# EasyEDA Pro project proprj_esp_s3_crokpocket_2025-06-12.epro, board PCB7
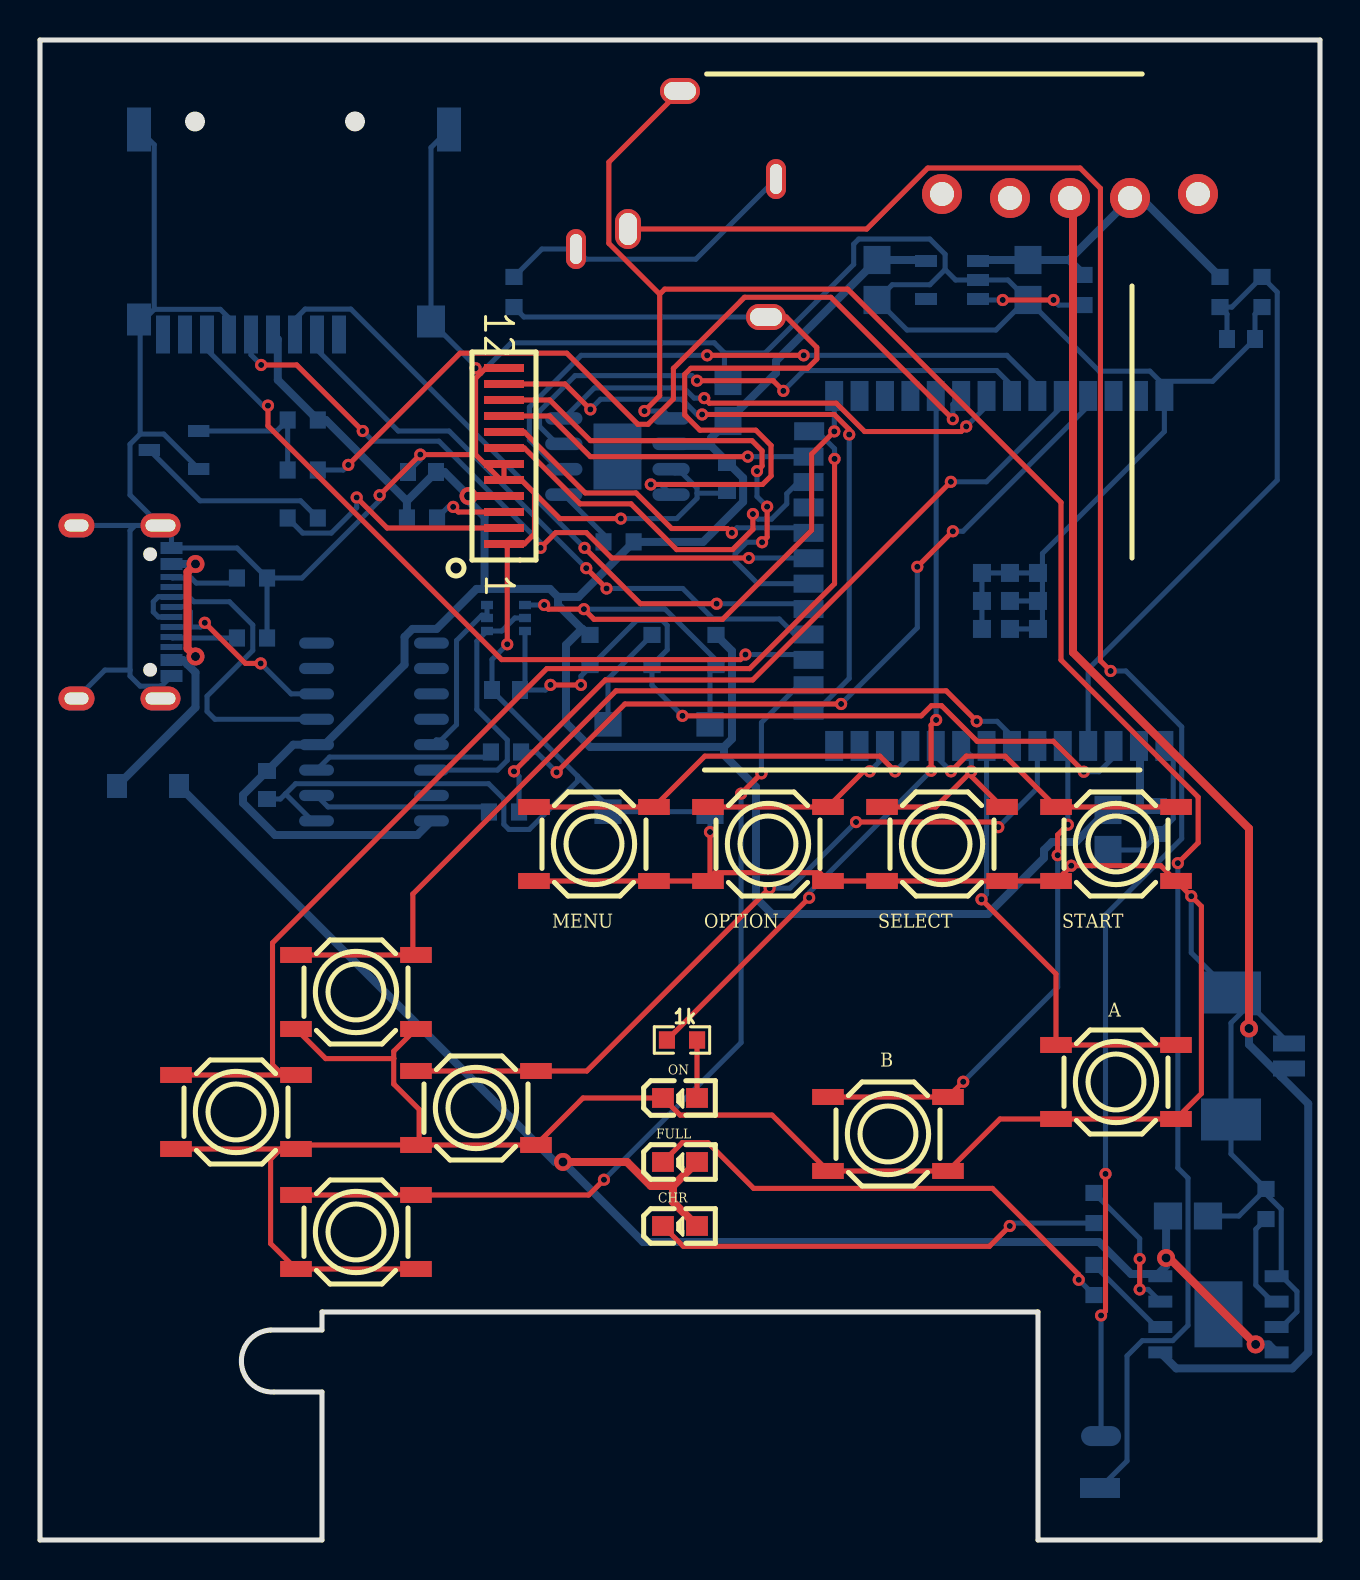
[diagram p1: board, top side]
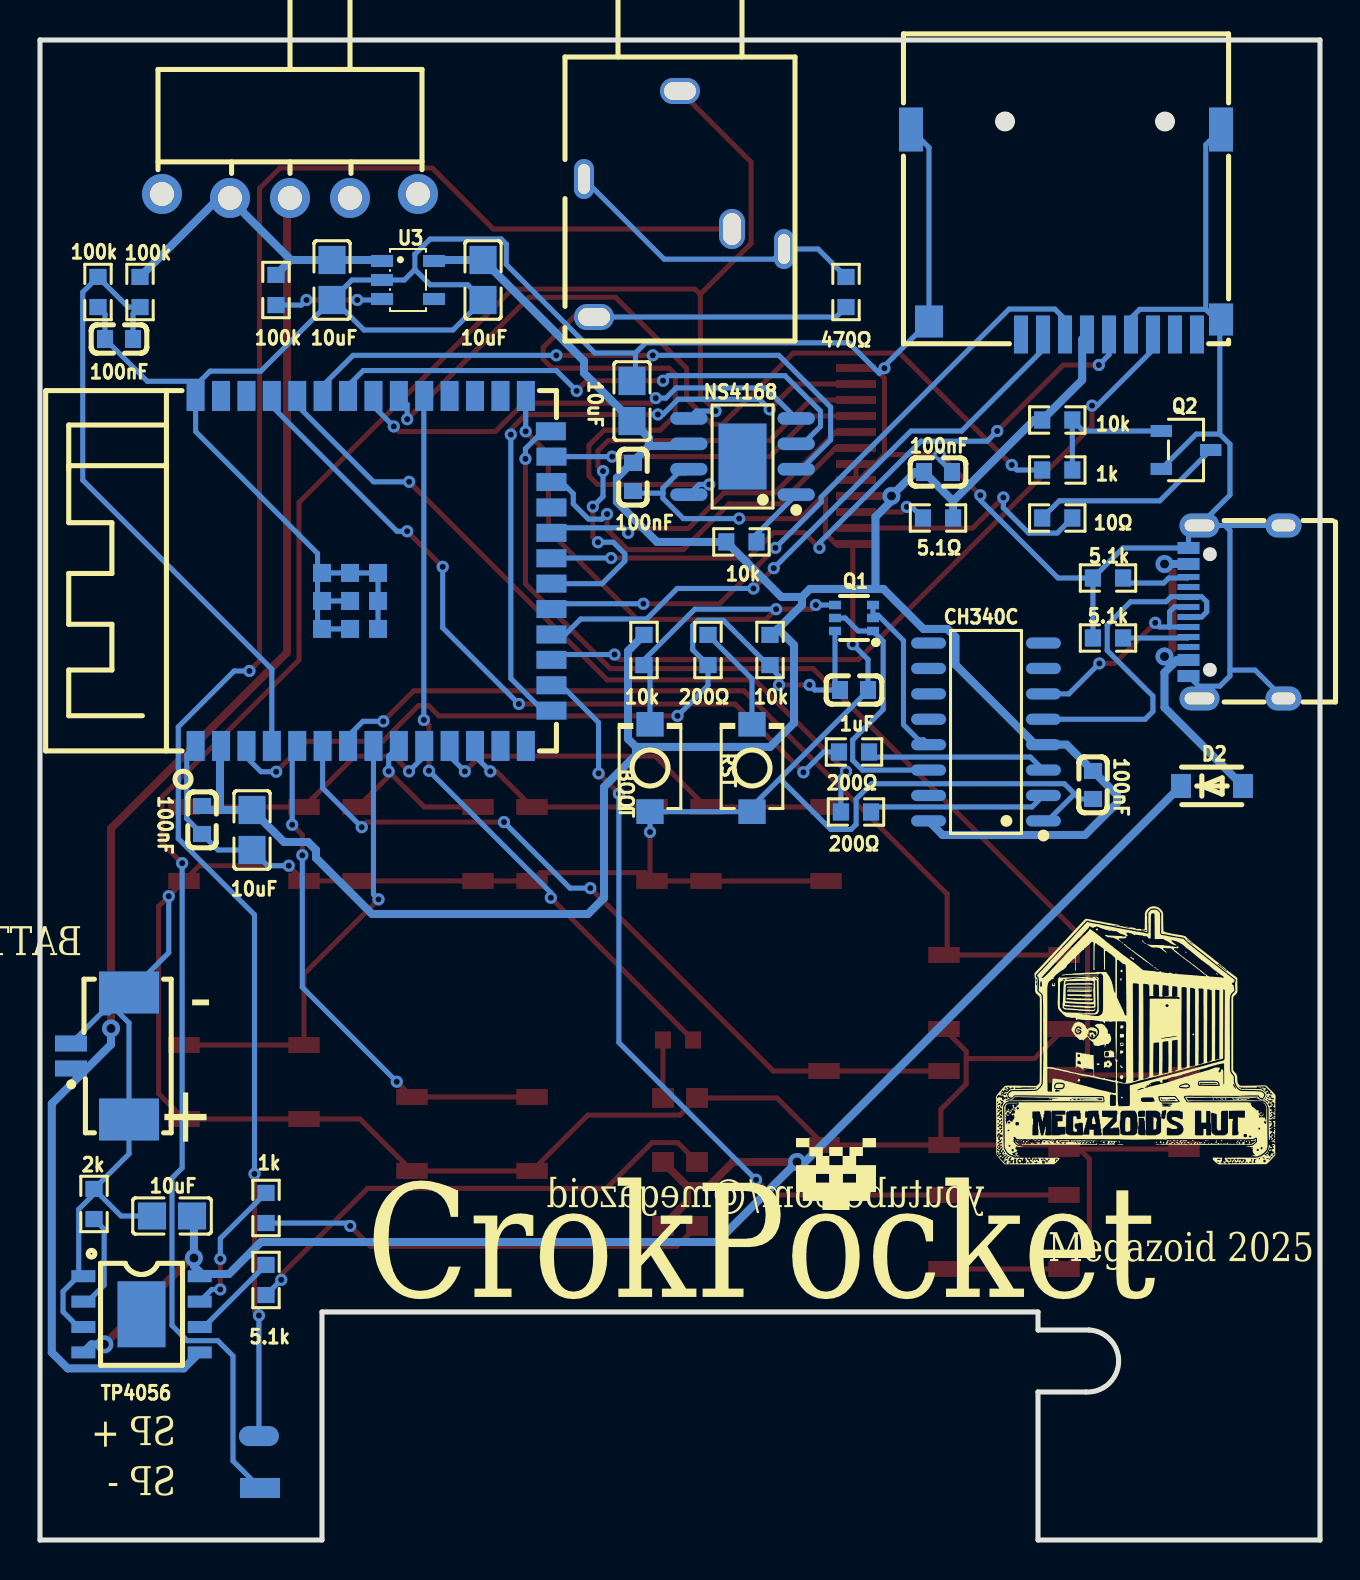
[diagram p2: board, bottom side, seen from below]

Outline 64 x 75 mm; copper layers: Top Layer, Bottom Layer. Coordinates in mm from the lower left corner of the outline.
Outline path: 0,75 64,75 64,0 49.9,0 49.9,11.4 14.1,11.4 14.1,10.5 11.54,10.5 arc(10.07,8.87) 11.7,7.4 14.1,7.4 14.1,0 0,0 0,75
Stack: Top Layer 0.035mm / Dielectric1 1.51mm FR4 er 4.5 / Bottom Layer 0.035mm

## Design rules (mm)
template: Custom Config
spacing copperThickness1oz (default): track to track 0.102, other pairs 0.152 to 0.3
spacing copperThickness2oz: track to track 0.203, other pairs 0.152 to 0.3
track width copperThickness1oz (default): min 0.127, default 0.254, max 2.54
track width copperThickness2oz: min 0.203, default 0.254, max 2.54
track width fat_trace: min 0.127, default 0.4, max 2.54
differential pair differentialPair (default): width min 0.127, default 0.254, max 2.54; gap min 0.152, default 0.152
via viaSize (default): diameter min 0.5, default 0.61, max 10; hole min 0.3, default 0.305, max 6.3
via fat_via: diameter min 0.5, default 0.9, max 10; hole min 0.3, default 0.45, max 6.3
net VCC uses fat_trace, fat_via
net VBUS uses fat_trace, fat_via
net $1N2657 uses fat_trace, fat_via
net BAT+ uses fat_trace, fat_via
net +5V uses fat_trace, fat_via

## Placement (name value [footprint] x y rotation side)
1k  -  [R0603]  32.1 25 0 top
1k#2  -  [R0603]  13.14 53.5 180 bottom
1k#3  -  [R0603]  52.7 16.6 90 bottom
1uF  1uF  [C0603]  23.3 42.5 180 bottom
2k  2kΩ  [R0603]  61.3 16.8 270 bottom
5.1k  -  [R0603]  52.7 13 90 bottom
5.1k#2  -  [R0603]  10.6 48.1 0 bottom
5.1k#3  -  [R0603]  10.6 45.1 0 bottom
5.1Ω  6.2Ω  [R0603]  19.1 51.1 0 bottom
10k  -  [R0603]  13.14 56 180 bottom
10k#2  -  [R0603]  27.5 44.5 90 bottom
10k#3  -  [R0603]  33.8 44.5 270 bottom
10k#4  -  [R0603]  28.93 49.91 0 bottom
10uF  -  [C0805]  53.4 35.5 270 bottom
10uF#2  -  [C0805]  41.85 63 90 bottom
10uF#3  -  [C0805]  49.4 63 90 bottom
10uF#4  -  [C0805]  57.4 16.2 0 bottom
10uF#5  -  [C0805]  34.4 56.95 270 bottom
10Ω  10Ω  [R0603]  13.14 51.1 180 bottom
100k  -  [R0603]  52.2 62.5 270 bottom
100k#2  -  [R0603]  59 62.4 90 bottom
100k#3  -  [R0603]  61.1 62.4 90 bottom
100nF  -  [C0603]  60.05 60.05 0 bottom
100nF#2  -  [C0603]  19.1 53.4 0 bottom
100nF#3  -  [C0603]  11.35 37.75 270 bottom
100nF#4  -  [C0603]  55.9 36 270 bottom
100nF#5  -  [C0603]  34.35 53.15 90 bottom
200Ω  -  [R0603]  23.2 36.4 180 bottom
200Ω#2  -  [R0603]  23.3 39.4 180 bottom
200Ω#3  -  [R0603]  30.6 44.5 270 bottom
470Ω  470Ω  [R0603]  23.7 62.4 90 bottom
A  GT-TC084E-H020-L5  [SW-SMD_4P-L5.2-W5.2-P3.70-LS6.4]  53.8 22.9 0 top
AUDIO1  PJ-3240-5A  [AUDIO-TH_PJ-3240-5A]  31.8 66.8 180 bottom
B  GT-TC084E-H020-L5  [SW-SMD_4P-L5.2-W5.2-P3.70-LS6.4]  42.4 20.3 0 top
BOOT  GT-TC029B-H025-L1N  [SW-SMD_L3.9-W3.0-P4.45]  33.5 38.6 90 bottom
CARD1  MR01A-01211  [TF-SMD_MR01A-01211]  12.7 65.4 0 bottom
CH340C  CH340C  [SOP-16_L10.0-W3.9-P1.27-LS6.0-BL]  16.7 40.4 90 bottom
CHR  RED  [LED-0603]  32 15.7 0 top
D2  SS14L  [SOD-123F_L2.8-W1.8-LS3.7-RD]  5.4 37.7 180 bottom
FULL  GREEN  [LED-0603]  32 18.9 0 top
H1  532610271  [CONN-SMD_532610271]  61 24.2 270 bottom
KEY_DOWN  GT-TC084E-H020-L5  [SW-SMD_4P-L5.2-W5.2-P3.70-LS6.4]  15.8 15.4 0 top
KEY_LEFT  GT-TC084E-H020-L5  [SW-SMD_4P-L5.2-W5.2-P3.70-LS6.4]  9.8 21.4 0 top
KEY_RIGHT  GT-TC084E-H020-L5  [SW-SMD_4P-L5.2-W5.2-P3.70-LS6.4]  21.8 21.6 0 top
KEY_UP  GT-TC084E-H020-L5  [SW-SMD_4P-L5.2-W5.2-P3.70-LS6.4]  15.8 27.4 0 top
LCD1  -  [LCD DISPLAY ER-TFT020-2]  23.2 54.2 180 top
MENU  HX TS5220A 160GF  [SW-SMD_4P-L5.2-W5.2-P3.70-LS6.4]  27.7 34.8 0 top
NS4168  NS4168  [ESOP-8_L4.9-W3.9-P1.27-LS6.0-BL-EP-1]  28.87 54.17 90 bottom
ON  GREEN  [LED-0603]  32 22.1 0 top
OPTION  HX TS5220A 160GF  [SW-SMD_4P-L5.2-W5.2-P3.70-LS6.4]  36.4 34.8 0 top
Q1  UMH3N  [SC-70-6_L2.2-W1.3-P0.65-LS2.1-BR]  23.3 46.1 180 bottom
Q2  S8050  [SOT-23-3_L2.9-W1.6-P1.90-LS2.8-BR]  6.7 54.5 0 bottom
RST  GT-TC029B-H025-L1N  [SW-SMD_L3.9-W3.0-P4.45]  28.4 38.6 90 bottom
SELECT  HX TS5220A 160GF  [SW-SMD_4P-L5.2-W5.2-P3.70-LS6.4]  45.1 34.8 0 top
START  HX TS5220A 160GF  [SW-SMD_4P-L5.2-W5.2-P3.70-LS6.4]  53.8 34.8 0 top
SW1  KH-SS12F23-G6  [SW-TH_KH-SS12F23-G6]  51.5 67.2 0 bottom
TP1  -  [Test-Point-0.5mm]  53.05 5.2 180 bottom
TP2  -  [Test-Point-0.5mm#2]  53 2.6 180 bottom
TP4056  TP4056-42-ESOP8  [ESOP-8_L4.9-W3.9-P1.27-LS6.0-BL-EP]  58.92 11.28 270 bottom
U1  ESP32-S3-WROOM-1-N16R8  [WIRELM-SMD_ESP32-S3-WROOM-1]  47.32 48.45 90 bottom
U3  XC6210B332MR-G  [SOT-23-5_L3.0-W1.7-P0.95-LS2.8-BR]  45.6 63 0 bottom
USB1  TYPE-C 16PIN 2MD(073)  [USB-C-SMD_TYPE-C-6PIN-2MD-073]  4.2 46.4 90 bottom

## Footprints (pads in the part's own frame, mm; a bottom-side part is the same pattern mirrored in y, then rotated)
AUDIO-TH_PJ-3240-5A
  oval 2x1.3 hole 1.6x0.9: 1(-0.2,5.65)
  oval 1x2 hole 0.6x1.502: 2(-5,1.248) 3(5,-2.252)
  oval 2x1.3 hole 1.601x0.9: 4(-4.5,-5.65)
  oval 1.3x2 hole 0.9x1.601: 5(2.4,-1.251)
C0603
  rect 0.8x0.9 smd: 1(-0.7,0) 2(0.7,0)
C0805
  rect 1.41x1.35 smd: 1(-1,0) 2(1,0)
CONN-SMD_532610271
  rect 0.8x1.6 smd: 1(0.625,-1.45) 2(-0.625,-1.45)
  rect 2.1x3 smd: 3(3.175,1.45) 4(-3.175,1.45)
ESOP-8_L4.9-W3.9-P1.27-LS6.0-BL-EP
  rect 0.6x1.2 smd: 1(-1.905,-2.909) 2(-0.635,-2.909) 3(0.635,-2.909) 4(1.905,-2.909) 5(1.905,2.909) 6(0.635,2.909) 7(-0.635,2.909) 8(-1.905,2.909)
  rect 3.3x2.4 smd: 9(0,0)
ESOP-8_L4.9-W3.9-P1.27-LS6.0-BL-EP-1
  oval 0.63x1.865 smd: 1(-1.905,-2.683) 2(-0.635,-2.683) 3(0.635,-2.683) 4(1.905,-2.683) 5(1.905,2.683) 6(0.635,2.683) 7(-0.635,2.683) 8(-1.905,2.683)
  rect 3.3x2.4 smd: 9(0,0)
LCD DISPLAY ER-TFT020-2
  rect 2x0.4 smd: 1(0,4.4) 2(0,3.6) 3(0,2.8) 4(0,2) 5(0,1.2) 6(0,0.4) 7(0,-0.4) 8(0,-1.2) 9(0,-2) 10(0,-2.8) 11(0,-3.6) 12(0,-4.4)
LED-0603
  rect 1.092x0.991 smd: 1(0.851,0) 2(-0.851,0)
R0603
  rect 0.806x0.864 smd: 1(-0.753,0) 2(0.753,0)
SC-70-6_L2.2-W1.3-P0.65-LS2.1-BR
  rect 0.6x0.42 smd: 1(0.95,-0.65) 2(0.95,0) 3(0.95,0.65) 4(-0.95,0.65) 5(-0.95,0) 6(-0.95,-0.65)
SOD-123F_L2.8-W1.8-LS3.7-RD
  rect 1x1.2 smd: 1(-1.55,0) 2(1.55,0)
SOP-16_L10.0-W3.9-P1.27-LS6.0-BL
  oval 0.56x1.745 smd: 1(-4.445,-2.873) 2(-3.175,-2.873) 3(-1.905,-2.873) 4(-0.635,-2.873) 5(0.635,-2.873) 6(1.905,-2.873) 7(3.175,-2.873) 8(4.445,-2.873) 9(4.445,2.873) 10(3.175,2.873) 11(1.905,2.873) 12(0.635,2.873) 13(-0.635,2.873) 14(-1.905,2.873) 15(-3.175,2.873) 16(-4.445,2.873)
SOT-23-3_L2.9-W1.6-P1.90-LS2.8-BR
  rect 1.07x0.6 smd: 1(1.235,-0.95) 2(1.235,0.95) 3(-1.235,0)
SOT-23-5_L3.0-W1.7-P0.95-LS2.8-BR
  rect 1.1x0.6 smd: 1(1.3,-0.95) 2(1.3,0) 3(1.3,0.95) 4(-1.3,0.95) 5(-1.3,-0.95)
SW-SMD_4P-L5.2-W5.2-P3.70-LS6.4
  rect 1.58x0.8 smd: 1(-3,1.85) 2(3,1.85) 3(-3,-1.85) 4(3,-1.85)
SW-SMD_L3.9-W3.0-P4.45
  rect 1.23x1.36 smd: 1(-2.185,0) 2(2.185,0)
SW-TH_KH-SS12F23-G6
  round 2 hole 1.2: 1(-3,0.1) 2(0,0.1) 3(3,0.1) 4(6.4,-0.1) 5(-6.4,-0.1)
Test-Point-0.5mm
  oval 2x1 smd: 1(0,0)
Test-Point-0.5mm#2
  rect 2x1 smd: 1(0,0)
TF-SMD_MR01A-01211
  rect 0.7x1.9 smd: 1(2.25,5.125) 2(1.15,5.125) 3(0.05,5.125) 4(-1.05,5.125) 5(-2.15,5.125) 6(-3.25,5.125) 7(-4.35,5.125) 8(-5.45,5.125) 9(-6.55,5.125)
  rect 1.2x1.6 smd: 10(-7.75,4.375)
  rect 1.2x2.2 smd: 11(-7.75,-5.125) 12(7.75,-5.125)
  rect 1.4x1.6 smd: 13(6.85,4.475)
USB-C-SMD_TYPE-C-6PIN-2MD-073
  rect 0.6x1.1 smd: 1(-3.2,2.375) 2(-2.4,2.375) 11(2.4,2.375) 12(3.2,2.375)
  rect 0.3x1.1 smd: 3(-1.75,2.375) 4(-1.25,2.375) 5(-0.75,2.375) 6(-0.25,2.375) 7(0.25,2.375) 8(0.75,2.375) 9(1.25,2.375) 10(1.75,2.375)
  oval 1.2x1.8 hole 0.6x1.2: 13(-4.325,-2.375) 14(4.325,-2.375)
  oval 1.2x2 hole 0.6x1.5: 13(-4.325,1.825) 14(4.325,1.825)
WIRELM-SMD_ESP32-S3-WROOM-1
  rect 1.5x0.9 smd: 1(-8.75,8.895) 2(-8.75,7.625) 3(-8.75,6.355) 4(-8.75,5.085) 5(-8.75,3.815) 6(-8.75,2.545) 7(-8.75,1.275) 8(-8.75,0.005) 9(-8.75,-1.265) 10(-8.75,-2.535) 11(-8.75,-3.805) 12(-8.75,-5.075) 13(-8.75,-6.345) 14(-8.75,-7.615) 27(8.75,-7.615) 28(8.75,-6.345) 29(8.75,-5.075) 30(8.75,-3.805) 31(8.75,-2.535) 32(8.75,-1.265) 33(8.75,0.005) 34(8.75,1.275) 35(8.75,2.545) 36(8.75,3.815) 37(8.75,5.085) 38(8.75,6.355) 39(8.75,7.625) 40(8.75,8.895)
  rect 0.9x1.5 smd: 15(-6.985,-8.895) 16(-5.715,-8.895) 17(-4.445,-8.895) 18(-3.175,-8.895) 19(-1.905,-8.895) 20(-0.635,-8.895) 21(0.635,-8.895) 22(1.905,-8.895) 23(3.175,-8.895) 24(4.445,-8.895) 25(5.715,-8.895) 26(6.985,-8.865)
  rect 0.9x0.9 smd: 41(-2.9,-0.225) 41(-2.9,1.175) 41(-2.9,2.575) 41(-1.5,-0.225) 41(-1.5,1.175) 41(-1.5,2.575) 41(-0.1,-0.225) 41(-0.1,1.175) 41(-0.1,2.575)

## Nets
+5V: 10uF#3.2 100k.1 100k#2.2 SW1.3 U3.1
GND: 1uF.2 2k.1 5.1k#2.2 5.1k#3.2 10uF.2 10uF#2.1 10uF#3.1 10uF#4.2 10uF#5.1 100k#3.1 100nF.2 100nF#2.1 100nF#3.2 100nF#4.2 100nF#5.1 A.3 A.4 B.3 B.4 BOOT.1 CARD1.6 CARD1.10 CARD1.11 CARD1.12 CARD1.13 CH340C.1 H1.2 H1.3 H1.4 KEY_DOWN.3 KEY_DOWN.4 KEY_LEFT.3 KEY_LEFT.4 KEY_RIGHT.3 KEY_RIGHT.4 KEY_UP.3 KEY_UP.4 LCD1.1 LCD1.5 LCD1.6 LCD1.12 MENU.3 MENU.4 NS4168.7 ON.2 OPTION.3 OPTION.4 Q2.2 RST.1 SELECT.3 SELECT.4 START.3 START.4 TP4056.1 TP4056.3 U1.1 U1.40 U1.41 U3.2 USB1.1 USB1.12 USB1.13 USB1.14
VBUS: 10uF#4.1 CHR.1 D2.1 FULL.1 TP4056.4 TP4056.8
VCC: 5.1Ω.1 10k.1 10k#2.2 10k#3.1 10k#4.2 10uF.1 10uF#2.2 10uF#5.2 100nF#2.2 100nF#3.1 100nF#4.1 100nF#5.2 CARD1.4 CH340C.4 CH340C.16 LCD1.4 NS4168.6 U1.2 U3.5
BAT+: H1.1 SW1.2 TP4056.5
D+: CH340C.5 USB1.6 USB1.8
D-: CH340C.6 USB1.5 USB1.7
DTR: CH340C.13 Q1.2 Q1.3
EN: 1uF.1 10k#2.1 200Ω#3.2 Q1.6 U1.3
HJ3: 470Ω.2 AUDIO1.2 AUDIO1.3
HJ_OUTP: AUDIO1.5 TP1.1
IO0: 10k#3.2 BOOT.2 Q1.4 U1.27
IO1: U1.39
IO2: U1.38
IO3: LCD1.11 U1.15
IO4: 100k#2.1 100k#3.2 100nF.1 U1.4
IO5: B.1 B.2 U1.5
IO6: KEY_RIGHT.1 KEY_RIGHT.2 U1.6
IO7: KEY_UP.1 KEY_UP.2 U1.7
IO8: OPTION.1 OPTION.2 U1.12
IO9: CARD1.7 U1.17
IO10: CARD1.2 U1.18
IO11: CARD1.3 U1.19
IO12: LCD1.10 U1.20
IO13: CARD1.5 U1.21
IO14: LCD1.8 U1.22
IO15: A.1 A.2 U1.8
IO16: SELECT.1 SELECT.2 U1.9
IO17: START.1 START.2 U1.10
IO18: MENU.1 MENU.2 U1.11
IO19: U1.13
IO20: U1.14
IO21: U1.23
IO38: 1k.1 U1.31
IO39: 1k#2.1 U1.32
IO40: NS4168.4 U1.33
IO41: NS4168.3 U1.34
IO42: NS4168.2 U1.35
IO45: KEY_LEFT.1 KEY_LEFT.2 U1.26
IO46: KEY_DOWN.1 KEY_DOWN.2 U1.16
IO47: LCD1.7 U1.24
IO48: LCD1.9 U1.25
RTS: CH340C.14 Q1.1 Q1.5
RXD: 200Ω.1 U1.36
SPK_OUTN: AUDIO1.1 NS4168.5 TP2.1
SPK_OUTP: 470Ω.1 AUDIO1.4 NS4168.8
TXD: 200Ω#2.1 U1.37
$1N2650: 5.1k#2.1 USB1.10
$1N2651: 5.1k#3.1 USB1.4
$1N2657: D2.2 USB1.2 USB1.11
$1N2665: 200Ω.2 CH340C.2
$1N2668: 200Ω#2.2 CH340C.3
$1N2752: 10k#4.1 NS4168.1
$1N2769: 200Ω#3.1 RST.2
$1N2808: 1k.2 ON.1
$1N9933: 10Ω.1 Q2.3
$1N9952: 1k#2.2 10k.2 Q2.1
$1N10458: 10Ω.2 LCD1.2
$1N10539: 5.1Ω.2 LCD1.3
$1N21961: 100k.2 U3.3
$1N22259: 5.1k.2 TP4056.6
$1N22358: 5.1k.1 FULL.2
$1N22434: 2k.2 TP4056.2
$1N22558: 1k#3.1 CHR.2
$1N22562: 1k#3.2 TP4056.7

Pads without a net: CARD1 1 8 9; CH340C 7 8 9 10 11 12 15; NS4168 9; SW1 1 4 5; TP4056 9; U1 28 29 30; U3 4; USB1 3 9

## Via types
v1: diameter 0.61, hole 0.305, Top Layer to Bottom Layer, 83 vias
v2: diameter 0.9, hole 0.45, Top Layer to Bottom Layer, 7 vias

## Routing (per net, layer and track width the routed paths; a pad name or vN(x,y) marks a point on that pad's centre or on a via; arc(x,y) is an arc through that point)
+5V: length 16.1
  Bottom Layer w0.4: U3.1 46.95,64 10uF#3.2 51.45,64 ; 54.5,67.05 SW1.3 ; 54.5,67.05 55.11,67.05 100k#2.2 ; 54.5,67.05 51.45,64 ; 51.45,64 100k.1
GND: length 411.1
  Top Layer w0.254: 24.72,52.34 24.06,53 LCD1.5 ; 24.72,52.34 24.72,50.31 24.22,49.8 LCD1.1 23.36,49.64 v1(23.36,44.79) ; 24.72,52.34 25.99,51.07 v1(29.04,51.07) ; 12.04,19.55 KEY_LEFT.4 13,19.75 KEY_RIGHT.3 18.96,19.75 ; 12.04,19.55 KEY_LEFT.3 ; 12.04,19.55 11.53,19.04 11.53,14.82 KEY_DOWN.3 KEY_DOWN.4 ; SELECT.3 SELECT.4 START.3 v1(51.56,33.71) 56.04,33.71 START.4 v1(57.56,32.19) 58.07,31.68 58.07,22.32 A.4 A.3 48,21.05 B.4 B.3 36.61,21.25 32,21.25 ON.2 27.15,22.1 KEY_RIGHT.4 18.96,19.75 ; 18.96,19.75 18.96,21.53 17.69,22.8 17.69,24.07 ; 21.78,54.27 23.05,53 LCD1.5 ; 21.78,54.27 v1(19.02,54.27) v1(16.98,52.24) ; 21.78,54.27 21.78,58.08 22.03,58.34 ; LCD1.5 LCD1.6 ; v1(33.5,35.4) 33.5,33.11 ; 33.5,33.11 OPTION.3 MENU.4 MENU.3 ; 33.5,33.11 33.75,33.37 38.98,33.37 OPTION.4 42.1,32.95 ; 22.03,58.34 22.3,58.6 LCD1.12 ; 22.03,58.34 v1(21.78,58.59) ; 17.69,24.07 14.28,24.07 KEY_UP.3 ; 17.69,24.07 17.69,24.44 KEY_UP.4
  Bottom Layer w0.254: 12.27,37.31 12.78,37.81 22.43,37.81 23.19,37.05 23.19,35.78 23.45,35.53 24.46,35.53 26.88,37.94 26.88,38.19 ; 12.27,37.31 13.62,35.96 CH340C.1 ; 12.27,37.31 12.02,37.05 100nF#3.2 ; 26.88,38.19 28.4,36.67 28.4,36.42 33.5,36.42 v1(33.5,35.4) ; 26.88,38.19 22.6,42.47 1uF.2 22.6,44.03 v1(23.36,44.79) ; 10uF#4.2 59.95,16.2 61.05,17.3 ; 100k#3.1 60.75,61.3 100nF.2 58.64,57.94 56,57.94 ; 61.05,17.3 61.3,17.3 62.06,16.54 62.06,13.42 TP4056.1 62.09,13.19 62.85,12.43 62.85,11.41 62.09,10.65 TP4056.3 ; 61.05,17.3 2k.1 59.55,19.3 H1.3 59.55,25.85 60.31,26.61 ; 56,57.94 55.5,58.45 52.96,58.45 10uF#3.1 ; 56,57.94 56,57.42 U1.40 56.22,55.43 50.12,49.33 50.12,48.31 ; 34.22,59.35 33.72,59.86 23.56,59.86 22.03,58.34 v1(21.78,58.59) 21.78,58.7 19.55,60.93 19.55,69.63 CARD1.12 ; 34.22,59.35 34.22,58.13 10uF#5.1 ; 34.22,59.35 36.26,59.35 40.68,63.78 40.68,64.8 40.94,65.05 44.49,65.05 45.26,64.29 45.26,63.53 ; 60.31,26.61 H1.4 57.56,29.36 v1(57.56,32.19) ; 60.31,26.61 60.57,26.36 60.92,26.36 H1.2 ; 32.85,52.34 34.24,52.34 100nF#5.1 ; 32.85,52.34 32.85,52.59 32.09,53.36 31.74,53.36 NS4168.7 ; 32.85,52.34 32.85,52.09 31.84,51.07 v1(29.04,51.07) ; 50.12,48.31 U1.41 U1.41 U1.41 U1.41 U1.41 ; 50.12,48.31 50.12,47.04 ; U1.1 56.66,39.26 56.66,36.06 100nF#4.2 55.1,34.5 10uF.2 52.61,33.71 v1(51.56,33.71) ; 5.01,55.3 4.5,54.79 4.5,52.25 6.03,50.73 ; 5.01,55.3 6.19,55.3 Q2.2 ; 5.01,55.3 5.01,60.97 CARD1.10 5.2,61.03 5.71,61.53 ; 4.5,43.5 3.25,43.5 USB1.13 ; 4.5,43.5 4.5,43.2 5.01,42.69 6.03,42.69 ; 4.5,43.5 4.5,50.47 4.75,50.73 ; U1.41 U1.41 49.99,47.04 50.12,47.04 ; CARD1.6 9.45,61.1 9.01,61.53 5.71,61.53 ; 50.12,47.04 50.12,45.78 U1.41 U1.41 ; 5.1k#2.2 5.1k#3.2 ; 5.1k#2.2 9.85,49.6 USB1.12 6.58,50.18 6.03,50.73 ; 5.1k#2.2 13.1,48.1 16.98,51.98 v1(16.98,52.24) ; 10uF#3.1 49.3,62 47.8,60.5 43.35,60.5 10uF#2.1 42.61,62.76 44.49,62.76 45.26,63.53 ; 10uF#3.1 48.4,63 U3.2 45.78,63 45.26,63.53 ; 100nF#2.1 19.02,54.02 v1(19.02,54.27) ; CARD1.11 5.71,69.76 5.71,61.53 ; 6.03,50.73 4.75,50.73 ; 4.75,50.73 1.83,50.73 ; USB1.1 6.07,42.69 6.03,42.69 ; 6.03,42.69 USB1.13
VBUS: length 80
  Top Layer w0.4: v2(56.3,14.1) 56.46,14.1 v2(60.78,9.78) ; 31.65,17.7 30.55,17.7 29.35,18.9 v2(26.15,18.9) ; 31.65,17.7 31.65,16.9 CHR.1 ; 31.65,17.7 FULL.1
  Bottom Layer w0.4: 10uF#4.1 56.3,16.11 56.3,13.7 55.9,13.3 ; TP4056.4 61.43,9.78 v2(60.78,9.78) ; 55.9,13.3 54.55,13.3 52.95,14.9 30.15,14.9 v2(26.15,18.9) 25.75,18.9 D2.1 ; 55.9,13.3 TP4056.8
VCC: length 143.5
  Top Layer w0.4: v2(21.43,52.2) LCD1.4
  Bottom Layer w0.4: 34.2,39.65 34.2,39.25 35.8,37.65 35.8,32.1 36.6,31.3 47.4,31.3 50.2,34.1 50.2,34.5 50.6,34.9 51.8,34.9 10uF.1 55,36.5 ; 34.2,39.65 27.5,39.65 26.3,40.85 26.3,44.75 27.1,45.55 ; 34.2,39.65 34.6,40.05 34.6,44.45 10k#3.1 ; 27.1,45.55 27.12,45.55 27.5,45.17 10k#2.2 ; 27.1,45.55 25.9,46.75 25.9,47.15 ; CH340C.16 18.87,35.25 11.75,35.25 10.15,36.85 10.15,37.25 100nF#3.1 12.66,39.77 CH340C.4 14.23,39.77 18.23,43.77 18.23,45.15 18.63,45.55 19.83,45.55 21.83,47.55 22.23,47.55 ; NS4168.6 31.66,54.71 33.56,54.71 ; 33.56,54.71 33.56,55.11 10uF#5.2 36.8,58.35 36.8,58.95 10uF#2.2 44.25,64 U3.5 ; 33.56,54.71 34.36,53.91 ; 34.36,53.91 35.16,53.11 35.16,51.91 33.16,49.91 10k#4.2 26.93,47.15 25.9,47.15 ; 34.36,53.91 100nF#5.2 ; 55,36.5 55,39.65 U1.2 ; 55,36.5 55.7,36.5 100nF#4.1 ; 18.35,51.95 5.1Ω.1 ; 18.35,51.95 14.29,56 10k.1 11.89,58 11.89,60.04 CARD1.4 ; 18.35,51.95 100nF#2.2 20.23,53.4 v2(21.43,52.2) 21.43,51.95 22.23,51.15 22.23,47.55 ; 25.9,47.15 25.5,47.55 22.23,47.55
BAT+: length 71.3
  Top Layer w0.4: SW1.2 51.65,66.95 51.65,44.38 60.45,35.58 v2(60.45,25.58)
  Bottom Layer w0.4: 62.05,23.18 63.41,21.81 63.41,9.38 62.61,8.58 56.82,8.58 TP4056.5 ; 62.05,23.18 H1.1 ; 62.05,23.18 60.45,24.78 v2(60.45,25.58)
D+: length 18.2
  Bottom Layer w0.254: CH340C.5 8.75,41.04 8.35,41.43 8.35,42.19 10.64,44.48 10.64,45.75 9.47,46.91 7.7,46.91 7.44,47.17 6.68,47.17 ; 6.68,47.17 USB1.8 ; 6.68,47.17 5.92,47.17 5.66,46.91 5.66,46.41 5.92,46.15 USB1.6
D-: length 10.6
  Top Layer w0.254: v1(8.24,45.86) 10.27,43.83 v1(11.03,43.83)
  Bottom Layer w0.254: 7.52,45.65 USB1.5 ; 7.52,45.65 7.52,46.41 7.27,46.67 6.59,46.67 USB1.7 ; 7.52,45.65 8.03,45.65 v1(8.24,45.86) ; v1(11.03,43.83) 12.56,42.31 CH340C.6
DTR: length 8.6
  Bottom Layer w0.254: 22.35,46.24 22.1,46.24 20.83,44.97 20.83,40.77 20.06,40 19.81,40 CH340C.13 ; 22.35,46.24 Q1.2 ; 22.35,46.24 Q1.3
EN: length 41.7
  Top Layer w0.254: v1(25.52,42.76) v1(27.05,42.76) ; v1(52.19,38.41) 50.67,39.94 46.86,39.94 45.08,41.72 44.57,41.72 44.06,41.21 v1(32.12,41.21)
  Bottom Layer w0.254: v1(32.12,41.21) 30.6,42.73 200Ω#3.2 31.36,44.51 31.36,45.73 31.11,45.99 29.84,45.99 27.05,43.2 v1(27.05,42.76) ; v1(52.19,38.41) 52.95,38.41 53.68,39.14 U1.3 ; Q1.6 24.25,42.75 1uF.1 25.27,42.5 v1(25.52,42.76)
HJ3: length 15.5
  Bottom Layer w0.254: AUDIO1.2 32.79,64.04 27.31,64.04 AUDIO1.3 25.09,64.55 470Ω.2
HJ_OUTP: length 91.5
  Top Layer w0.254: v1(53.28,18.31) 53.28,11.45 v1(53.05,11.23) ; AUDIO1.5 41.34,65.55 44.39,68.6 52.01,68.6 53.02,67.58 53.02,43.96 v1(53.53,43.45)
  Bottom Layer w0.254: v1(53.53,43.45) 54.29,43.45 57.09,40.66 57.09,35.07 53.28,31.26 v1(53.28,18.31) ; v1(53.05,11.23) TP1.1
IO0: length 34.6
  Top Layer w0.254: v1(25.21,46.75) 25.42,46.54 v1(27.2,46.54) 27.7,46.03 34.13,46.03 38.58,50.49 38.58,54.3 v1(39.72,55.43)
  Bottom Layer w0.254: v1(25.21,46.75) Q1.4 ; v1(39.72,55.43) 39.72,57.2 ; v1(27.2,46.54) 31.26,46.54 33.8,44 10k#3.2 33.5,43.45 BOOT.2
IO3: length 33.8
  Top Layer w0.254: v1(40.46,55.27) 40.46,55.53 39.71,56.28 v1(33.11,56.28) ; LCD1.11 26.25,57.8 v1(27.52,56.53)
  Bottom Layer w0.254: U1.15 38.52,41.56 38.94,41.56 40.46,43.08 v1(40.46,55.27) ; v1(33.11,56.28) 32.85,56.28 32.09,57.04 28.03,57.04 v1(27.52,56.53)
IO4: length 32.1
  Bottom Layer w0.254: U1.4 52.41,43.54 61.86,52.99 61.86,62.39 100k#3.2 59.59,61.65 100k#2.1 59.35,61.3 100nF.1
IO5: length 26.1
  Top Layer w0.254: v1(50.88,34.24) 50.88,35.26 v1(51.39,35.76) ; B.1 B.2 v1(46.16,22.91)
  Bottom Layer w0.254: v1(50.88,34.24) 50.88,27.64 v1(46.16,22.91) ; v1(51.39,35.76) 51.39,39.45 U1.5
IO6: length 39.2
  Top Layer w0.254: KEY_RIGHT.1 KEY_RIGHT.2 27.34,23.45 v1(36.48,32.59) ; v1(40.8,35.9) 47.66,35.9 v1(47.91,35.64)
  Bottom Layer w0.254: v1(36.48,32.59) 37.5,32.59 v1(40.8,35.9) ; v1(47.91,35.64) 49.87,37.6 U1.6
IO7: length 44.6
  Top Layer w0.254: 18.64,29.25 18.64,32.3 28.8,42.46 45.31,42.46 v1(46.84,40.94) ; 18.64,29.25 KEY_UP.1 ; 18.64,29.25 KEY_UP.2
  Bottom Layer w0.254: U1.7 48.6,40.19 47.85,40.94 v1(46.84,40.94)
IO8: length 10.4
  Top Layer w0.254: v1(41.49,38.43) 41.18,38.43 OPTION.2 OPTION.1
  Bottom Layer w0.254: U1.12 42.25,39.19 v1(41.49,38.43)
IO9: length 38.1
  Top Layer w0.254: v1(11.4,56.72) 11.4,55.7 23.08,44.02 35.02,44.02 v1(35.27,44.27)
  Bottom Layer w0.254: v1(11.4,56.72) 11.14,56.72 8.35,59.51 CARD1.7 ; U1.17 38.16,44.27 v1(35.27,44.27)
IO10: length 31.2
  Top Layer w0.254: v1(27.31,48.59) v1(28.33,47.58)
  Bottom Layer w0.254: v1(27.31,48.59) 20.45,55.45 17.91,55.45 13.85,59.51 CARD1.2 ; v1(28.33,47.58) 32.14,47.58 33.66,46.05 36.96,46.05 37.73,45.29 38.42,45.29 U1.18
IO11: length 33
  Top Layer w0.254: v1(27.23,49.61) 30.02,46.81 v1(33.83,46.81)
  Bottom Layer w0.254: v1(33.83,46.81) 38.16,46.81 U1.19 ; v1(27.23,49.61) 24.94,51.89 24.94,52.15 15.54,61.55 13.26,61.55 12.75,61.04 CARD1.3
IO12: length 25
  Top Layer w0.254: v1(36.36,51.67) 36.36,50.14 v1(36.1,49.89) ; LCD1.10 25.49,57 27.52,54.97 35.6,54.97 36.1,54.46 36.1,53.7 v1(35.85,53.45)
  Bottom Layer w0.254: v1(36.36,51.67) 35.85,52.18 v1(35.85,53.45) ; U1.20 35.89,47.82 34.76,48.95 34.76,49.31 35.34,49.89 v1(36.1,49.89)
IO13: length 33.9
  Top Layer w0.254: v1(25.03,49.61) 25.79,50.37 27.31,50.37 28.58,49.1 v1(35.44,49.1) ; v1(11.06,58.75) 12.84,58.75 v1(16.14,55.45)
  Bottom Layer w0.254: U1.21 38.42,49.1 v1(35.44,49.1) ; CARD1.5 10.55,59.26 v1(11.06,58.75) ; v1(16.14,55.45) 16.65,54.94 19.95,54.94 25.03,49.86 v1(25.03,49.61)
IO14: length 17.5
  Top Layer w0.254: v1(34.59,50.36) 34.38,50.58 31.58,50.58 29.8,52.35 27.26,52.35 24.22,55.4 LCD1.8
  Bottom Layer w0.254: v1(34.59,50.36) 34.85,50.61 38.17,50.61 U1.22
IO15: length 22.6
  Top Layer w0.254: A.2 A.1 50.8,28.31 v1(47.07,32.03)
  Bottom Layer w0.254: U1.8 47.33,32.29 v1(47.07,32.03)
IO16: length 9.1
  Top Layer w0.254: SELECT.1 44.79,36.65 v1(46.57,38.43) 46.57,38.19 SELECT.2
  Bottom Layer w0.254: U1.9 46.57,39.19 v1(46.57,38.43)
IO17: length 14.2
  Top Layer w0.254: v1(45.55,38.43) 46.31,39.19 48.26,39.19 START.1 START.2
  Bottom Layer w0.254: v1(45.55,38.43) 44.79,39.19 U1.10
IO18: length 21
  Top Layer w0.254: v1(42.76,38.43) 41.99,39.19 33.24,39.19 MENU.2 MENU.1
  Bottom Layer w0.254: U1.11 43.52,39.19 v1(42.76,38.43)
IO38: length 37.8
  Top Layer w0.254: 1k.1 v1(38.46,32.11) ; v1(44.55,38.46) 44.55,40.75 v1(44.81,41)
  Bottom Layer w0.254: v1(44.55,38.46) 38.46,32.37 v1(38.46,32.11) ; v1(44.81,41) 44.81,57.18 U1.31
IO39: length 43
  Top Layer w0.254: v1(45.64,56.04) 39.54,62.14 35.23,62.14 31.67,58.58 31.67,57.06 30.4,55.79 29.89,55.79 26.34,59.34 21,59.34 v1(15.41,53.76)
  Bottom Layer w0.254: 1k#2.1 15.16,53.5 v1(15.41,53.76) ; U1.32 45.64,56.79 v1(45.64,56.04)
IO40: length 23.7
  Top Layer w0.254: v1(46.31,55.68) 46.06,55.43 41.23,55.43 39.82,56.84 33.47,56.84 v1(33.21,57.1)
  Bottom Layer w0.254: v1(33.21,57.1) 32.7,57.1 32.2,57.6 27.71,57.6 NS4168.4 ; U1.33 47.33,56.7 v1(46.31,55.68)
IO41: length 28.3
  Top Layer w0.254: v1(32.85,57.97) 36.66,57.97 v1(37.17,57.46)
  Bottom Layer w0.254: v1(32.85,57.97) 32.6,58.22 26.75,58.22 24.98,56.44 24.98,55.68 25.85,54.81 NS4168.3 ; U1.34 48.6,57.71 47.84,58.47 38.18,58.47 v1(37.17,57.46)
IO42: length 31.6
  Top Layer w0.254: v1(38.18,59.23) v1(33.36,59.23)
  Bottom Layer w0.254: v1(38.18,59.23) 48.34,59.23 49.87,57.71 U1.35 ; NS4168.2 25.94,53.54 24.47,55.01 24.47,56.64 27.06,59.23 v1(33.36,59.23)
IO45: length 56.7
  Top Layer w0.254: KEY_LEFT.1 12.13,23.25 ; 12.13,23.25 11.63,23.76 11.63,29.86 25.34,43.57 35.48,43.57 39.73,47.82 v1(39.73,54.06) ; 12.13,23.25 KEY_LEFT.2
  Bottom Layer w0.254: U1.26 38.57,55.33 38.97,55.33 39.73,54.56 v1(39.73,54.06)
IO46: length 45
  Top Layer w0.254: KEY_DOWN.1 KEY_DOWN.2 27.44,17.25 v1(28.2,18.01) ; v1(35.06,37.32) v1(36.07,38.33)
  Bottom Layer w0.254: v1(28.2,18.01) 35.06,24.87 v1(35.06,37.32) ; U1.16 38.34,42.65 37.85,42.65 36.07,40.87 v1(36.07,38.33)
IO47: length 19.7
  Top Layer w0.254: v1(35.65,51.3) 35.65,50.54 34.63,49.52 31.84,49.52 29.55,51.81 27.01,51.81 24.22,54.6 LCD1.7
  Bottom Layer w0.254: U1.24 37.92,52.9 37.34,52.31 37.34,51.81 36.58,51.05 35.9,51.05 v1(35.65,51.3)
IO48: length 16.1
  Top Layer w0.254: LCD1.9 25.49,56.2 27.52,54.17 v1(35.39,54.17)
  Bottom Layer w0.254: v1(35.39,54.17) U1.25
RTS: length 13.5
  Bottom Layer w0.254: Q1.5 23.74,46.1 23.09,45.45 Q1.1 21.84,44.94 21.84,41.53 23.37,40 23.37,38.99 22.87,38.5 CH340C.14
RXD: length 37.6
  Top Layer w0.254: v1(45.54,52.91) 35.64,43.01 28.27,43.01 v1(23.7,38.43)
  Bottom Layer w0.254: v1(23.7,38.43) 23.95,38.18 200Ω.1 ; v1(45.54,52.91) 47.32,52.91 51.13,56.72 51.13,57.2
SPK_OUTN: length 100.4
  Top Layer w0.254: 30.98,62.29 28.44,64.83 28.44,68.9 AUDIO1.1 ; 30.98,62.29 30.98,57.21 v1(30.22,56.45) ; 30.98,62.29 31.24,62.55 40.38,62.55 51.05,51.88 51.05,44 57.91,37.15 57.91,34.86 v1(56.89,33.84)
  Bottom Layer w0.254: v1(56.89,33.84) 56.89,18.6 57.4,18.09 57.4,10.73 56.64,9.97 55.11,9.97 54.35,9.21 54.35,3.95 TP2.1 ; NS4168.5 31.19,56.45 v1(30.22,56.45)
SPK_OUTP: length 39.4
  Top Layer w0.254: AUDIO1.4 37.32,61.15 38.84,59.63 38.84,59.05 38.38,58.59 32.54,58.59 32.24,58.28 32.24,56.25 33,55.49 35.79,55.49 36.55,54.73 36.55,53.2 36.13,52.78 v1(30.54,52.78)
  Bottom Layer w0.254: 470Ω.1 24.2,61.15 AUDIO1.4 ; NS4168.8 31.05,52.78 v1(30.54,52.78)
TXD: length 38.7
  Top Layer w0.254: v1(25.83,38.39) 29.25,41.8 v1(40.06,41.8) ; v1(43.87,48.66) v1(45.64,50.44)
  Bottom Layer w0.254: v1(45.64,50.44) 46.15,50.44 52.41,56.7 U1.37 ; v1(43.87,48.66) 43.87,45.61 v1(40.06,41.8) ; 200Ω#2.1 24.82,39.4 v1(25.83,38.39)
$1N2650: length 3.5
  Bottom Layer w0.254: USB1.10 6.62,48.1 7.56,48.1 7.81,47.85 9.59,47.85 5.1k#2.1
$1N2651: length 3.3
  Bottom Layer w0.254: 5.1k#3.1 6.62,45.1 USB1.4
$1N2657: length 15.5
  Top Layer w0.4: v2(7.78,44.18) 7.38,44.58 7.38,48.4 v2(7.78,48.8)
  Bottom Layer w0.4: 7.38,43.78 7.78,43.38 7.78,41.63 D2.2 ; 7.38,43.78 7.15,44 USB1.2 ; 7.38,43.78 v2(7.78,44.18) ; v2(7.78,48.8) USB1.11
$1N2665: length 9
  Bottom Layer w0.254: 13.83,37.23 14.4,36.66 22.19,36.66 200Ω.2
$1N2668: length 9.1
  Bottom Layer w0.254: CH340C.3 14.48,39.15 22.29,39.15 200Ω#2.2
$1N2752: length 3.2
  Bottom Layer w0.254: 10k#4.1 28.18,50.28 NS4168.1
$1N2769: length 5.4
  Bottom Layer w0.254: 200Ω#3.1 28.4,43.05 RST.2
$1N2808: length 2.9
  Top Layer w0.254: 1k.2 32.85,22.1
$1N9933: length 9.8
  Bottom Layer w0.254: 10Ω.1 13.03,51.96 8,51.96 Q2.3
$1N9952: length 7.2
  Bottom Layer w0.254: Q2.1 11.83,55.45 10k.2 1k#2.2
$1N10458: length 12.8
  Top Layer w0.254: LCD1.2 17.36,50.6 v1(15.83,52.12)
  Bottom Layer w0.254: v1(15.83,52.12) 15.83,51.62 14.56,50.35 13.14,50.35 10Ω.2
$1N10539: length 3.7
  Top Layer w0.254: v1(20.66,51.66) 20.91,51.4 LCD1.3
  Bottom Layer w0.254: 5.1Ω.2 20.41,51.66 v1(20.66,51.66)
$1N21961: length 5.4
  Top Layer w0.254: v1(50.68,62) v1(48.14,62)
  Bottom Layer w0.254: v1(50.68,62) 50.93,61.75 100k.2 ; U3.3 46.95,62 v1(48.14,62)
$1N22259: length 4.6
  Bottom Layer w0.254: 5.1k.2 55.8,10.65 TP4056.6
$1N22358: length 25.3
  Top Layer w0.254: FULL.2 32.12,19.87 33.4,19.87 35.68,17.58 47.62,17.58 51.94,13.26 v1(51.94,13.01)
  Bottom Layer w0.254: 5.1k.1 v1(51.94,13.01)
$1N22434: length 4.9
  Bottom Layer w0.254: TP4056.2 61.62,11.92 60.79,12.75 60.79,15.54 2k.2
$1N22558: length 22.5
  Top Layer w0.254: CHR.2 32.16,14.69 47.47,14.69 v1(48.49,15.7)
  Bottom Layer w0.254: v1(48.49,15.7) 48.64,15.85 1k#3.1
$1N22562: length 7.1
  Top Layer w0.254: v1(54.99,14.05) v1(54.99,12.53)
  Bottom Layer w0.254: v1(54.99,14.05) 54.99,15.07 1k#3.2 ; TP4056.7 55.41,12.53 v1(54.99,12.53)

## Copper pours and planes (outline as drawn; the poured copper is in the pictures)
GND on Top Layer: -1.3,74.4 -1.28,74.69 -1.22,74.96 -1.12,75.23 -0.98,75.48 -0.81,75.71 -0.61,75.91 -0.38,76.08 -0.13,76.22 0.14,76.32 0.42,76.38 0.7,76.4 63.5,76.4 63.78,76.38 64.06,76.32 64.33,76.22 64.58,76.08 64.81,75.91 65.01,75.71 65.18,75.48 65.32,75.23 65.42,74.96 65.48,74.69 65.5,74.4 65.5,0.7 65.48,0.42 65.42,0.14 65.32,-0.13 65.18,-0.38 65.01,-0.61 64.81,-0.81 64.58,-0.98 64.33,-1.12 64.06,-1.22 63.78,-1.28 63.5,-1.3 0.7,-1.3 0.42,-1.28 0.14,-1.22 -0.13,-1.12 -0.38,-0.98 -0.61,-0.81 -0.81,-0.61 -0.98,-0.38 -1.12,-0.13 -1.22,0.14 -1.28,0.42 -1.3,0.7
GND on Bottom Layer: -3.15,77.65 67.15,77.65 67.15,-2.85 -3.15,-2.85

## Text on the board
Bottom Silkscreen Layer: youtube.com/@megazoid | SP + | SP - | BATTERY | Megazoid 2025 | - | + | CrokPocket
Top Silkscreen Layer: 12 | 1
